# Altium schematic sheet Connectores.SchDoc
size B; SheetNumber: 5; SheetTotal: 5
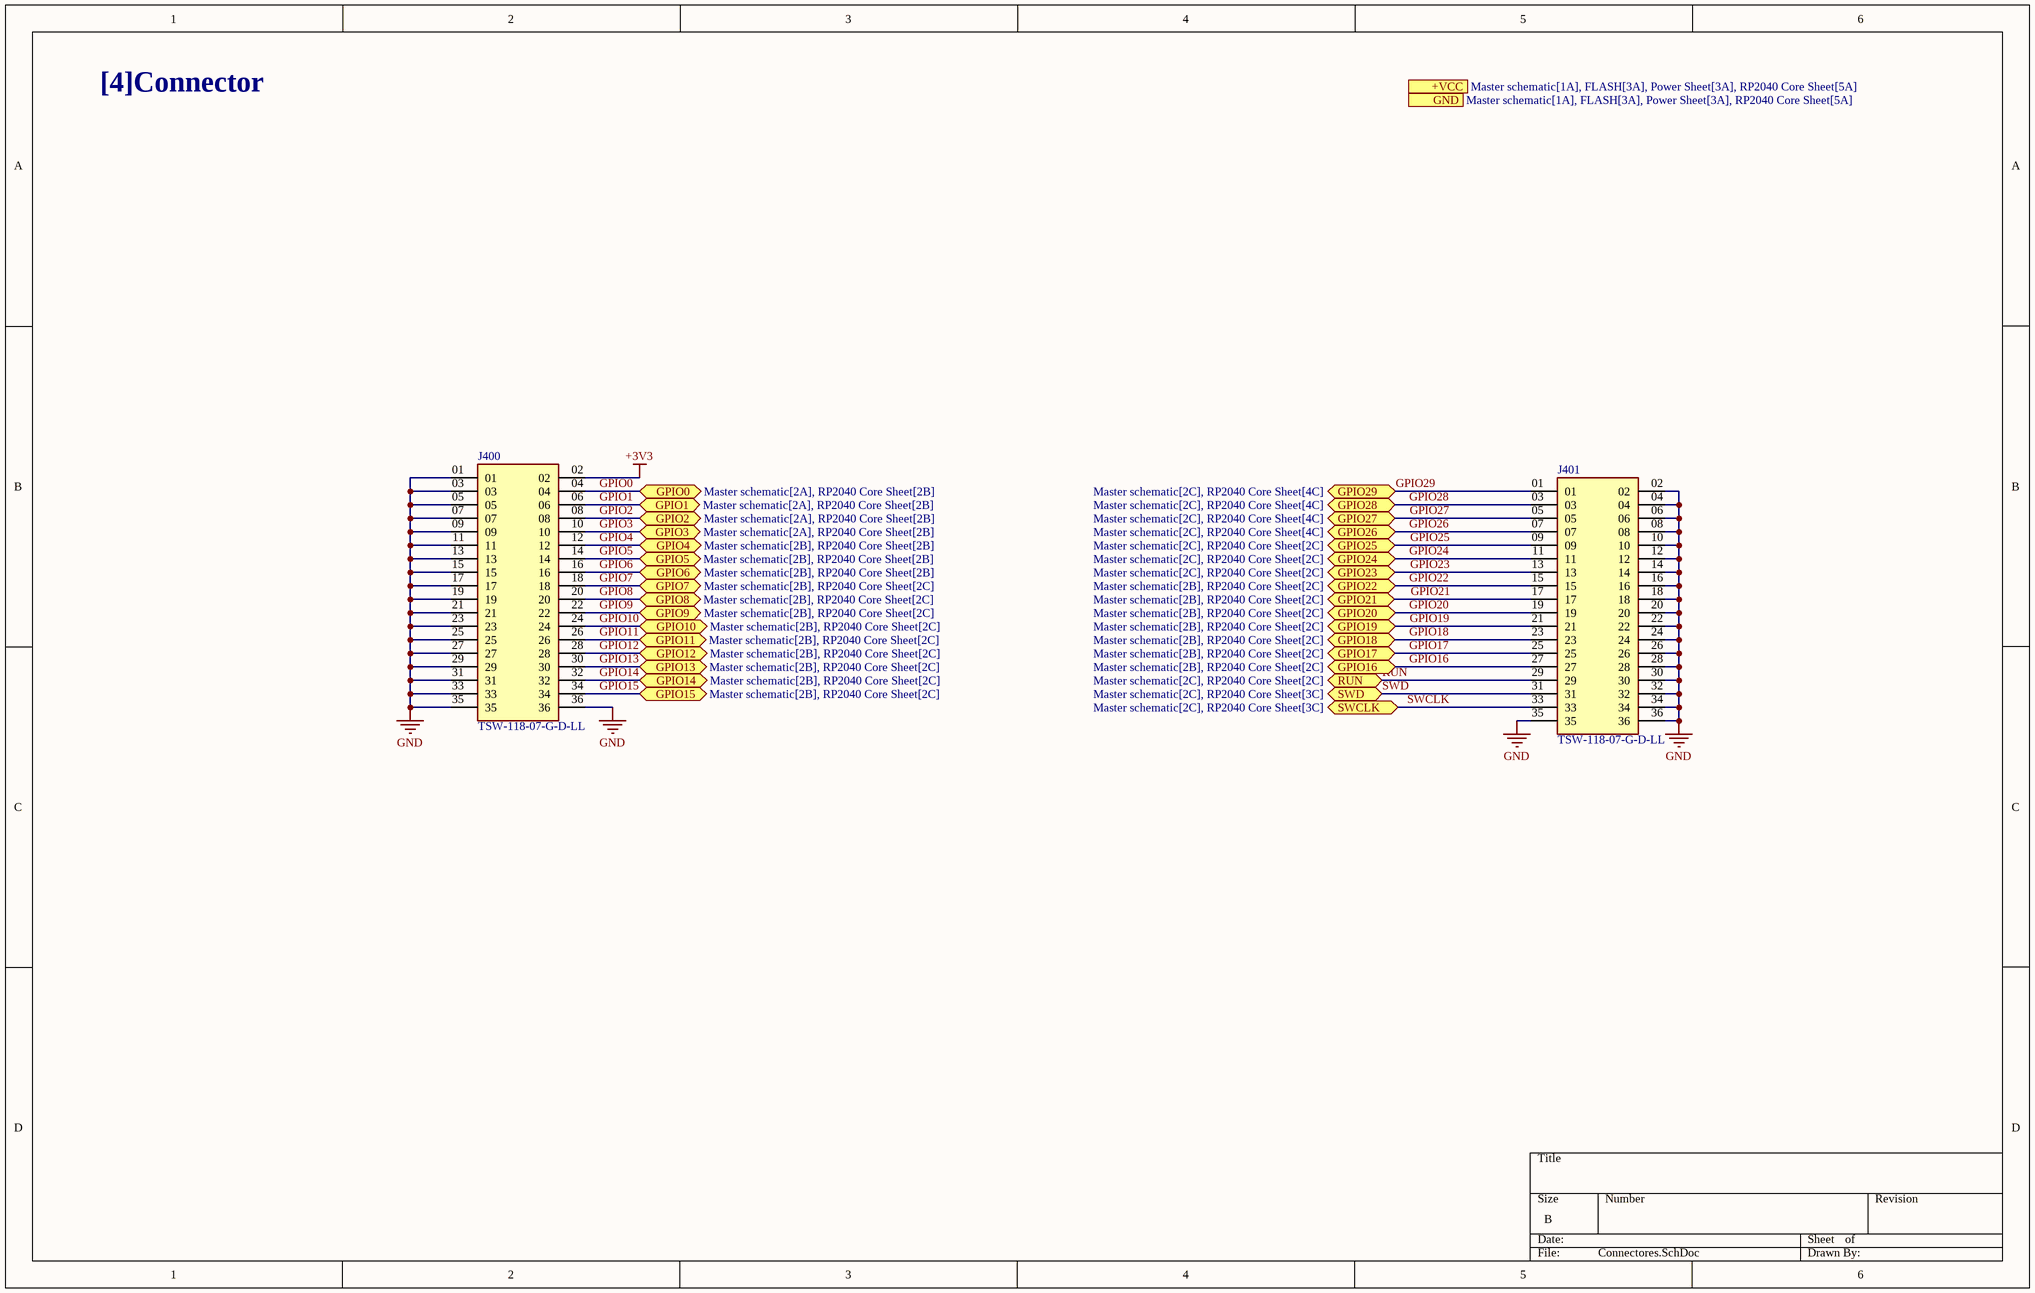
[diagram p0: Connectores.SchDoc]

## Parts
J400  TSW-118-07-G-D-LL  [SAMTEC_TSW-118-07-G-D-LL]
J401  TSW-118-07-G-D-LL  [SAMTEC_TSW-118-07-G-D-LL]

## Ports
+VCC (see Master schematic[1A], FLASH[3A], Power Sheet[3A], RP2040 Core Sheet[5A]), GND (see Master schematic[1A], FLASH[3A], Power Sheet[3A], RP2040 Core Sheet[5A]), GPIO0 (bidir, see Master schematic[2A], RP2040 Core Sheet[2B]), GPIO1 (bidir, see Master schematic[2A], RP2040 Core Sheet[2B]), GPIO2 (bidir, see Master schematic[2A], RP2040 Core Sheet[2B]), GPIO3 (bidir, see Master schematic[2A], RP2040 Core Sheet[2B]), GPIO4 (bidir, see Master schematic[2B], RP2040 Core Sheet[2B]), GPIO5 (bidir, see Master schematic[2B], RP2040 Core Sheet[2B]), GPIO6 (bidir, see Master schematic[2B], RP2040 Core Sheet[2B]), GPIO7 (bidir, see Master schematic[2B], RP2040 Core Sheet[2C]), GPIO8 (bidir, see Master schematic[2B], RP2040 Core Sheet[2C]), GPIO9 (bidir, see Master schematic[2B], RP2040 Core Sheet[2C]), GPIO10 (bidir, see Master schematic[2B], RP2040 Core Sheet[2C]), GPIO11 (bidir, see Master schematic[2B], RP2040 Core Sheet[2C]), GPIO12 (bidir, see Master schematic[2B], RP2040 Core Sheet[2C]), GPIO13 (bidir, see Master schematic[2B], RP2040 Core Sheet[2C]), GPIO14 (bidir, see Master schematic[2B], RP2040 Core Sheet[2C]), GPIO15 (bidir, see Master schematic[2B], RP2040 Core Sheet[2C]), GPIO16 (bidir, see Master schematic[2B], RP2040 Core Sheet[2C]), GPIO17 (bidir, see Master schematic[2B], RP2040 Core Sheet[2C]), GPIO18 (bidir, see Master schematic[2B], RP2040 Core Sheet[2C]), GPIO19 (bidir, see Master schematic[2B], RP2040 Core Sheet[2C]), GPIO20 (bidir, see Master schematic[2B], RP2040 Core Sheet[2C]), GPIO21 (bidir, see Master schematic[2B], RP2040 Core Sheet[2C]), GPIO22 (bidir, see Master schematic[2B], RP2040 Core Sheet[2C]), GPIO23 (bidir, see Master schematic[2C], RP2040 Core Sheet[2C]), GPIO24 (bidir, see Master schematic[2C], RP2040 Core Sheet[2C]), GPIO25 (bidir, see Master schematic[2C], RP2040 Core Sheet[2C]), GPIO26 (bidir, see Master schematic[2C], RP2040 Core Sheet[4C]), GPIO27 (bidir, see Master schematic[2C], RP2040 Core Sheet[4C]), GPIO28 (bidir, see Master schematic[2C], RP2040 Core Sheet[4C]), GPIO29 (bidir, see Master schematic[2C], RP2040 Core Sheet[4C]), RUN (bidir, see Master schematic[2C], RP2040 Core Sheet[2C]), SWCLK (bidir, see Master schematic[2C], RP2040 Core Sheet[3C]), SWD (bidir, see Master schematic[2C], RP2040 Core Sheet[3C])

## Nets
+3V3: J400.02
GND: J400.01 J400.03 J400.05 J400.07 J400.09 J400.11 J400.13 J400.15 J400.17 J400.19 J400.21 J400.23 J400.25 J400.27 J400.29 J400.31 J400.33 J400.35 J400.36 J401.02 J401.04 J401.06 J401.08 J401.10 J401.12 J401.14 J401.16 J401.18 J401.20 J401.22 J401.24 J401.26 J401.28 J401.30 J401.32 J401.34 J401.35 J401.36
GPIO0: J400.04 ; port GPIO0
GPIO1: J400.06 ; port GPIO1
GPIO2: J400.08 ; port GPIO2
GPIO3: J400.10 ; port GPIO3
GPIO4: J400.12 ; port GPIO4
GPIO5: J400.14 ; port GPIO5
GPIO6: J400.16 ; port GPIO6
GPIO7: J400.18 ; port GPIO7
GPIO8: J400.20 ; port GPIO8
GPIO9: J400.22 ; port GPIO9
GPIO10: J400.24 ; port GPIO10
GPIO11: J400.26 ; port GPIO11
GPIO12: J400.28 ; port GPIO12
GPIO13: J400.30 ; port GPIO13
GPIO14: J400.32 ; port GPIO14
GPIO15: J400.34 ; port GPIO15
GPIO16: J401.27 ; port GPIO16
GPIO17: J401.25 ; port GPIO17
GPIO18: J401.23 ; port GPIO18
GPIO19: J401.21 ; port GPIO19
GPIO20: J401.19 ; port GPIO20
GPIO21: J401.17 ; port GPIO21
GPIO22: J401.15 ; port GPIO22
GPIO23: J401.13 ; port GPIO23
GPIO24: J401.11 ; port GPIO24
GPIO25: J401.09 ; port GPIO25
GPIO26: J401.07 ; port GPIO26
GPIO27: J401.05 ; port GPIO27
GPIO28: J401.03 ; port GPIO28
GPIO29: J401.01 ; port GPIO29
RUN: J401.29 ; port RUN
SWCLK: J401.33 ; port SWCLK
SWD: J401.31 ; port SWD

## Notes on the sheet
- [4]Connector

## Library data of the parts
J400 J401 = TSW-118-07-G-D-LL: Package: None; Price: None; Value: *; MP: TSW-118-07-G-D-LL; Availability: Unavailable